# EasyEDA schematic DsKy with chained TM1638s.json
TITLE: DsKy w/Chained TM1636; REV: 1.0; Date: 2019-12-31; Sheet: 1/1; Drawn By: psnichols1; Company: Your Company
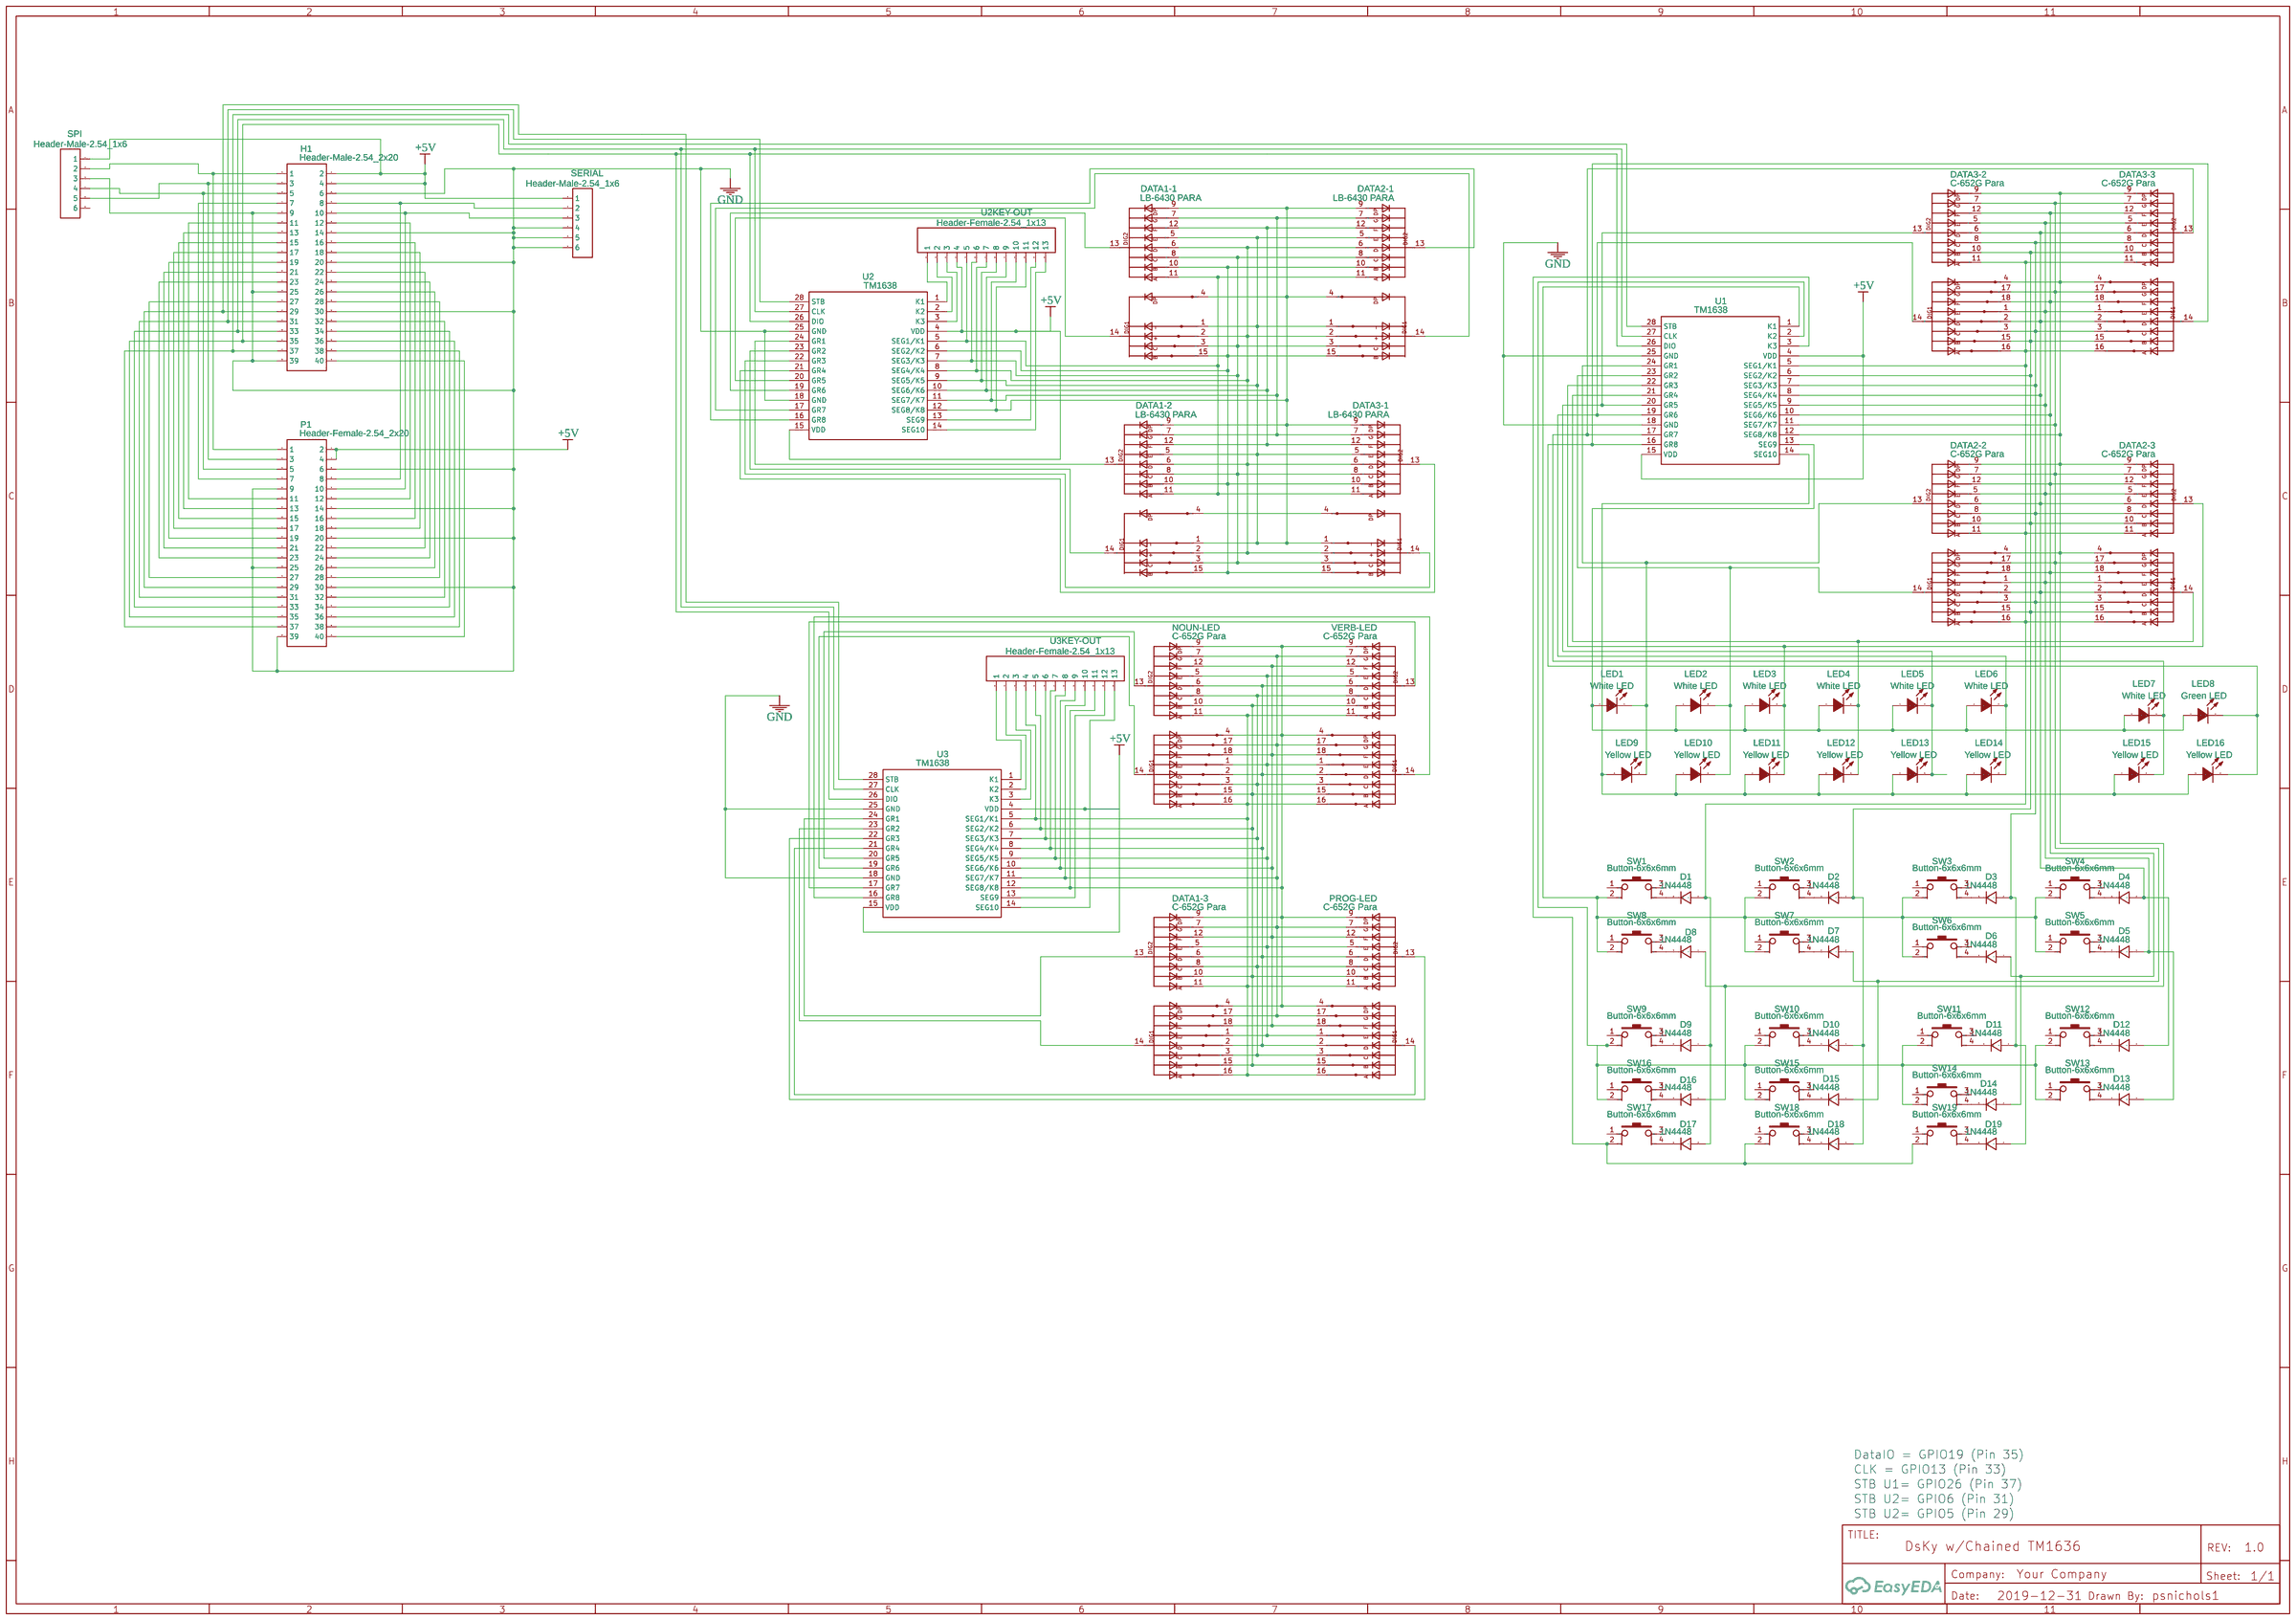
[diagram p0: schematic sheet]

## Parts
D1  1N4448  [DO-35]
D2  1N4448  [DO-35]
D3  1N4448  [DO-35]
D4  1N4448  [DO-35]
D5  1N4448  [DO-35]
D6  1N4448  [DO-35]
D7  1N4448  [DO-35]
D8  1N4448  [DO-35]
D9  1N4448  [DO-35]
D10  1N4448  [DO-35]
D11  1N4448  [DO-35]
D12  1N4448  [DO-35]
D13  1N4448  [DO-35]
D14  1N4448  [DO-35]
D15  1N4448  [DO-35]
D16  1N4448  [DO-35]
D17  1N4448  [DO-35]
D18  1N4448  [DO-35]
D19  1N4448  [DO-35]
DATA1-1  LB-6430 PARA  [LED-SEG-TH_TOD-3203FMR-1N]
DATA1-2  LB-6430 PARA  [LED-SEG-TH_TOD-3203FMR-1N]
DATA1-3  C-652G Para  [LED-SEG-TH_TOD-3203FMR-1N]
DATA2-1  LB-6430 PARA  [LED-SEG-TH_TOD-3203FMR-1N]
DATA2-2  C-652G Para  [LED-SEG-TH_TOD-3203FMR-1N]
DATA2-3  C-652G Para  [LED-SEG-TH_TOD-3203FMR-1N]
DATA3-1  LB-6430 PARA  [LED-SEG-TH_TOD-3203FMR-1N]
DATA3-2  C-652G Para  [LED-SEG-TH_TOD-3203FMR-1N]
DATA3-3  C-652G Para  [LED-SEG-TH_TOD-3203FMR-1N]
H1  Header-Male-2.54_2x20  [HDR-TH_40P-P2.54-V-R2-C20-S2.54]
LED1  White LED  [LED-3MM/2.54]
LED2  White LED  [LED-3MM/2.54]
LED3  White LED  [LED-3MM/2.54]
LED4  White LED  [LED-3MM/2.54]
LED5  White LED  [LED-3MM/2.54]
LED6  White LED  [LED-3MM/2.54]
LED7  White LED  [LED-3MM/2.54]
LED8  Green LED  [LED-3MM/2.54]
LED9  Yellow LED  [LED-3MM/2.54]
LED10  Yellow LED  [LED-3MM/2.54]
LED11  Yellow LED  [LED-3MM/2.54]
LED12  Yellow LED  [LED-3MM/2.54]
LED13  Yellow LED  [LED-3MM/2.54]
LED14  Yellow LED  [LED-3MM/2.54]
LED15  Yellow LED  [LED-3MM/2.54]
LED16  Yellow LED  [LED-3MM/2.54]
NOUN-LED  C-652G Para  [LED-SEG-TH_TOD-3203FMR-1N]
P1  Header-Female-2.54_2x20  [HDR-TH_40PIN-V-ROW2-COL20-FEMALE-PITCH2.54]
PROG-LED  C-652G Para  [LED-SEG-TH_TOD-3203FMR-1N]
SERIAL  Header-Male-2.54_1x6  [HDR-TH_6P-P2.54-V]
SPI  Header-Male-2.54_1x6  [HDR-TH_6P-P2.54-V]
SW1  Button-6x6x6mm  [SW-TH_4PIN-L6.00-W6.00]
SW2  Button-6x6x6mm  [SW-TH_4PIN-L6.00-W6.00]
SW3  Button-6x6x6mm  [SW-TH_4PIN-L6.00-W6.00]
SW4  Button-6x6x6mm  [SW-TH_4PIN-L6.00-W6.00]
SW5  Button-6x6x6mm  [SW-TH_4PIN-L6.00-W6.00]
SW6  Button-6x6x6mm  [SW-TH_4PIN-L6.00-W6.00]
SW7  Button-6x6x6mm  [SW-TH_4PIN-L6.00-W6.00]
SW8  Button-6x6x6mm  [SW-TH_4PIN-L6.00-W6.00]
SW9  Button-6x6x6mm  [SW-TH_4PIN-L6.00-W6.00]
SW10  Button-6x6x6mm  [SW-TH_4PIN-L6.00-W6.00]
SW11  Button-6x6x6mm  [SW-TH_4PIN-L6.00-W6.00]
SW12  Button-6x6x6mm  [SW-TH_4PIN-L6.00-W6.00]
SW13  Button-6x6x6mm  [SW-TH_4PIN-L6.00-W6.00]
SW14  Button-6x6x6mm  [SW-TH_4PIN-L6.00-W6.00]
SW15  Button-6x6x6mm  [SW-TH_4PIN-L6.00-W6.00]
SW16  Button-6x6x6mm  [SW-TH_4PIN-L6.00-W6.00]
SW17  Button-6x6x6mm  [SW-TH_4PIN-L6.00-W6.00]
SW18  Button-6x6x6mm  [SW-TH_4PIN-L6.00-W6.00]
SW19  Button-6x6x6mm  [SW-TH_4PIN-L6.00-W6.00]
U1  TM1638  [SOIC-28_300MIL]
U2  TM1638  [SOIC-28_300MIL]
U2KEY-OUT  Header-Female-2.54_1x13  [HDR-TH_13P-P2.54-V]
U3  TM1638  [SOIC-28_300MIL]
U3KEY-OUT  Header-Female-2.54_1x13  [HDR-TH_13P-P2.54-V]
VERB-LED  C-652G Para  [LED-SEG-TH_TOD-3203FMR-1N]

## Library data of the parts
D1-D19 = 1N4448: Supplier: LCSC; Manufacturer: SEMTECH; image: //image.lceda.cn/szlcsc/C54037.jpg; Supplier Part: C54037
DATA1-1 DATA1-2 DATA2-1 DATA3-1 = LB-6430 PARA: Supplier Part: Not Avail; Manufacturer: Para Light; Manufacturer Part: C-652G; Contributor: Peter Nichols
DATA1-3 DATA2-2 DATA2-3 DATA3-2 DATA3-3 NOUN-LED PROG-LED VERB-LED = C-652G Para: Supplier Part: Not Avail; Manufacturer: Para Light; Manufacturer Part: C-652G; Contributor: Peter Nichols
H1 = Header-Male-2.54_2x20: Supplier: LCSC; Manufacturer: ReliaPro; image: http://image.lceda.cn/szlcsc/C50980.jpg; Supplier Part: C50980
LED1-LED16 = 204-10SURD/S530-A3: Supplier: LCSC; Manufacturer: EVERLIGHT; Supplier Part: C99772
P1 = Header-Female-2.54_2x20: Supplier: LCSC; Manufacturer: BOOMELE; Manufacturer Part: 2.54mm 2*20PFemale header; image: //image.lceda.cn/szlcsc/C50982.jpg; Supplier Part: C50982
SERIAL SPI = Header-Male-2.54_1x6: Supplier: LCSC; Manufacturer: BOOMELE; Supplier Part: C37208
SW1-SW19 = Button-6x6x6mm: Supplier Part: C71836; Supplier: LCSC; Manufacturer: BBJ; Manufacturer Part: Switch,6*6*6Plastic head,260G, 0.25mm,Straight line
U1-U3 = TM1638: Supplier: LCSC; Manufacturer: TM; LCSC Assembly: Yes; image: //image.lceda.cn/szlcsc/C19187.jpg; Supplier Part: C19187; SMT Type: Basic
U2KEY-OUT U3KEY-OUT = Header-Female-2.54_1x13: Supplier: LCSC; Manufacturer: BOOMELE; Manufacturer Part: Female header 2.54-1*13P; Supplier Part: C52709

## Nets
+5V: H1.2 H1.4 P1.2 P1.4 SERIAL.1 SPI.1 U1.4(VDD) U1.15(VDD) U2.4(VDD) U2.15(VDD) U2KEY-OUT.4 U3.4(VDD) U3.15(VDD)
GND: H1.6 H1.9 H1.14 H1.20 H1.25 H1.30 H1.39 P1.6 P1.9 P1.14 P1.20 P1.25 P1.30 P1.39 SERIAL.4 SERIAL.5 SERIAL.6 SPI.3 U1.18(GND) U1.25(GND) U2.18(GND) U2.25(GND) U3.18(GND) U3.25(GND)
Net-(D1-1): D1.1(A) D9.1(A) D17.1(A) DATA2-2.11(3) DATA2-2.16(3) DATA2-3.11(3) DATA2-3.16(3) DATA3-2.11(3) DATA3-2.16(3) DATA3-3.11(3) DATA3-3.16(3) U1.5(SEG1/K1)
Net-(D1-2): D1.2(K) SW1.4
Net-(D2-1): D2.1(A) D10.1(A) D18.1(A) DATA2-2.10(3) DATA2-2.15(9) DATA2-3.10(3) DATA2-3.15(9) DATA3-2.10(3) DATA3-2.15(9) DATA3-3.10(3) DATA3-3.15(9) U1.6(SEG2/K2)
Net-(D2-2): D2.2(K) SW2.4
Net-(D3-1): D3.1(A) D11.1(A) D19.1(A) DATA2-2.3(8) DATA2-2.8(3) DATA2-3.3(8) DATA2-3.8(3) DATA3-2.3(8) DATA3-2.8(3) DATA3-3.3(8) DATA3-3.8(3) U1.7(SEG3/K3)
Net-(D3-2): D3.2(K) SW3.4
Net-(D4-1): D4.1(A) D12.1(A) DATA2-2.2(6) DATA2-2.6(3) DATA2-3.2(6) DATA2-3.6(3) DATA3-2.2(6) DATA3-2.6(3) DATA3-3.2(6) DATA3-3.6(3) U1.8(SEG4/K4)
Net-(D4-2): D4.2(K) SW4.4
Net-(D5-1): D5.1(A) D13.1(A) DATA2-2.1(7) DATA2-2.5(3) DATA2-3.1(7) DATA2-3.5(3) DATA3-2.1(7) DATA3-2.5(3) DATA3-3.1(7) DATA3-3.5(3) U1.9(SEG5/K5)
Net-(D5-2): D5.2(K) SW5.4
Net-(D6-1): D6.1(A) D14.1(A) DATA2-2.12(3) DATA2-2.18(4) DATA2-3.12(3) DATA2-3.18(4) DATA3-2.12(3) DATA3-2.18(4) DATA3-3.12(3) DATA3-3.18(4) U1.10(SEG6/K6)
Net-(D6-2): D6.2(K) SW6.4
Net-(D7-1): D7.1(A) D15.1(A) DATA2-2.7(3) DATA2-2.17(1) DATA2-3.7(3) DATA2-3.17(1) DATA3-2.7(3) DATA3-2.17(1) DATA3-3.7(3) DATA3-3.17(1) U1.11(SEG7/K7)
Net-(D7-2): D7.2(K) SW7.4
Net-(D8-1): D8.1(A) D16.1(A) DATA2-2.4(2) DATA2-2.9(3) DATA2-3.4(2) DATA2-3.9(3) DATA3-2.4(2) DATA3-2.9(3) DATA3-3.4(2) DATA3-3.9(3) U1.12(SEG8/K8)
Net-(D8-2): D8.2(K) SW8.4
Net-(D9-2): D9.2(K) SW9.4
Net-(D10-2): D10.2(K) SW10.4
Net-(D11-2): D11.2(K) SW11.4
Net-(D12-2): D12.2(K) SW12.4
Net-(D13-2): D13.2(K) SW13.4
Net-(D14-2): D14.2(K) SW14.4
Net-(D15-2): D15.2(K) SW15.4
Net-(D16-2): D16.2(K) SW16.4
Net-(D17-2): D17.2(K) SW17.4
Net-(D18-2): D18.2(K) SW18.4
Net-(D19-2): D19.2(K) SW19.4
Net-(DATA1-1-1): DATA1-1.1(7) DATA1-1.4(2) DATA1-1.5(3) DATA1-1.9(3) DATA1-2.1(7) DATA1-2.5(3) DATA1-2.9(3) DATA2-1.1(7) DATA2-1.4(2) DATA2-1.5(3) DATA2-1.9(3) DATA3-1.1(7) DATA3-1.5(3) DATA3-1.9(3) U2.9(SEG5/K5) U2.12(SEG8/K8) U2KEY-OUT.8 U2KEY-OUT.11
Net-(DATA1-1-2): DATA1-1.2(6) DATA1-1.6(3) DATA1-2.2(6) DATA1-2.6(3) DATA2-1.2(6) DATA2-1.6(3) DATA3-1.2(6) DATA3-1.6(3) U2.8(SEG4/K4) U2KEY-OUT.7
Net-(DATA1-1-3): DATA1-1.3(8) DATA1-1.8(3) DATA1-2.3(8) DATA1-2.8(3) DATA2-1.3(8) DATA2-1.8(3) DATA3-1.3(8) DATA3-1.8(3) U2.7(SEG3/K3) U2KEY-OUT.6
Net-(DATA1-1-7): DATA1-1.7(3) DATA1-2.7(3) DATA2-1.7(3) DATA3-1.7(3) U2.11(SEG7/K7) U2KEY-OUT.10
Net-(DATA1-1-10): DATA1-1.10(3) DATA1-1.15(9) DATA1-2.10(3) DATA1-2.15(9) DATA2-1.10(3) DATA2-1.15(9) DATA3-1.10(3) DATA3-1.15(9) U2.6(SEG2/K2)
Net-(DATA1-1-11): DATA1-1.11(3) DATA1-2.11(3) DATA2-1.11(3) DATA3-1.11(3) U2.5(SEG1/K1) U2KEY-OUT.5
Net-(DATA1-1-12): DATA1-1.12(3) DATA1-2.12(3) DATA2-1.12(3) DATA3-1.12(3) U2.10(SEG6/K6) U2KEY-OUT.9
Net-(DATA1-1-13): DATA1-1.13(5) U2.19(GR6)
Net-(DATA1-1-14): DATA1-1.14(10) U2.20(GR5)
Net-(DATA1-2-4): DATA1-2.4(2) DATA3-1.4(2)
Net-(DATA1-2-13): DATA1-2.13(5) U2.24(GR1)
Net-(DATA1-2-14): DATA1-2.14(10) U2.23(GR2)
Net-(DATA1-3-1): DATA1-3.1(7) DATA1-3.5(3) NOUN-LED.1(7) NOUN-LED.5(3) PROG-LED.1(7) PROG-LED.5(3) U3.9(SEG5/K5) U3KEY-OUT.8 VERB-LED.1(7) VERB-LED.5(3)
Net-(DATA1-3-2): DATA1-3.2(6) DATA1-3.6(3) NOUN-LED.2(6) NOUN-LED.6(3) PROG-LED.2(6) PROG-LED.6(3) U3.8(SEG4/K4) U3KEY-OUT.7 VERB-LED.2(6) VERB-LED.6(3)
Net-(DATA1-3-3): DATA1-3.3(8) DATA1-3.8(3) NOUN-LED.3(8) NOUN-LED.8(3) PROG-LED.3(8) PROG-LED.8(3) U3.7(SEG3/K3) U3KEY-OUT.6 VERB-LED.3(8) VERB-LED.8(3)
Net-(DATA1-3-4): DATA1-3.4(2) DATA1-3.9(3) NOUN-LED.4(2) NOUN-LED.9(3) PROG-LED.4(2) PROG-LED.9(3) U3.12(SEG8/K8) U3KEY-OUT.11 VERB-LED.4(2) VERB-LED.9(3)
Net-(DATA1-3-7): DATA1-3.7(3) DATA1-3.17(1) NOUN-LED.7(3) NOUN-LED.17(1) PROG-LED.7(3) PROG-LED.17(1) U3.11(SEG7/K7) U3KEY-OUT.10 VERB-LED.7(3) VERB-LED.17(1)
Net-(DATA1-3-10): DATA1-3.10(3) DATA1-3.15(9) NOUN-LED.10(3) NOUN-LED.15(9) PROG-LED.10(3) PROG-LED.15(9) U3.6(SEG2/K2) U3KEY-OUT.5 VERB-LED.10(3) VERB-LED.15(9)
Net-(DATA1-3-11): DATA1-3.11(3) DATA1-3.16(3) NOUN-LED.11(3) NOUN-LED.16(3) PROG-LED.11(3) PROG-LED.16(3) U3.5(SEG1/K1) U3KEY-OUT.4 VERB-LED.11(3) VERB-LED.16(3)
Net-(DATA1-3-12): DATA1-3.12(3) DATA1-3.18(4) NOUN-LED.12(3) NOUN-LED.18(4) PROG-LED.12(3) PROG-LED.18(4) U3.10(SEG6/K6) U3KEY-OUT.9 VERB-LED.12(3) VERB-LED.18(4)
Net-(DATA1-3-13): DATA1-3.13(5) U3.24(GR1)
Net-(DATA1-3-14): DATA1-3.14(10) U3.23(GR2)
Net-(DATA2-1-13): DATA2-1.13(5) U2.16(GR8)
Net-(DATA2-1-14): DATA2-1.14(10) U2.17(GR7)
Net-(DATA2-2-13): DATA2-2.13(5) LED1.2(K) LED9.2(K) U1.24(GR1)
Net-(DATA2-2-14): DATA2-2.14(10) LED2.2(K) LED10.2(K) U1.23(GR2)
Net-(DATA2-3-13): DATA2-3.13(5) LED3.2(K) LED11.2(K) U1.22(GR3)
Net-(DATA2-3-14): DATA2-3.14(10) LED4.2(K) LED12.2(K) U1.21(GR4)
Net-(DATA3-1-13): DATA3-1.13(5) U2.21(GR4)
Net-(DATA3-1-14): DATA3-1.14(10) U2.22(GR3)
Net-(DATA3-2-13): DATA3-2.13(5) LED5.2(K) LED13.2(K) U1.20(GR5)
Net-(DATA3-2-14): DATA3-2.14(10) LED6.2(K) LED14.2(K) U1.19(GR6)
Net-(DATA3-3-13): DATA3-3.13(5) LED7.2(K) LED15.2(K) U1.17(GR7)
Net-(DATA3-3-14): DATA3-3.14(10) LED8.2(K) LED16.2(K) U1.16(GR8)
Net-(H1-1): H1.1 P1.1 SPI.2
Net-(H1-3): H1.3 P1.3 SPI.5
Net-(H1-5): H1.5 P1.5 SPI.4
Net-(H1-7): H1.7 P1.7
Net-(H1-8): H1.8 P1.8 SERIAL.2
Net-(H1-10): H1.10 P1.10 SERIAL.3
Net-(H1-11): H1.11 P1.11
Net-(H1-12): H1.12 P1.12
Net-(H1-13): H1.13 P1.13
Net-(H1-15): H1.15 P1.15
Net-(H1-16): H1.16 P1.16
Net-(H1-17): H1.17 P1.17
Net-(H1-18): H1.18 P1.18
Net-(H1-19): H1.19 P1.19
Net-(H1-21): H1.21 P1.21
Net-(H1-22): H1.22 P1.22
Net-(H1-23): H1.23 P1.23
Net-(H1-24): H1.24 P1.24
Net-(H1-26): H1.26 P1.26
Net-(H1-27): H1.27 P1.27
Net-(H1-28): H1.28 P1.28
Net-(H1-29): H1.29 P1.29 U3.28(STB)
Net-(H1-31): H1.31 P1.31 U2.28(STB)
Net-(H1-32): H1.32 P1.32
Net-(H1-33): H1.33 P1.33 U1.27(CLK) U2.27(CLK) U3.27(CLK)
Net-(H1-34): H1.34 P1.34
Net-(H1-35): H1.35 P1.35 U1.26(DIO) U2.26(DIO) U3.26(DIO)
Net-(H1-36): H1.36 P1.36
Net-(H1-37): H1.37 P1.37 U1.28(STB)
Net-(H1-38): H1.38 P1.38
Net-(H1-40): H1.40 P1.40
Net-(LED1-1): LED1.1(A) LED2.1(A) LED3.1(A) LED4.1(A) LED5.1(A) LED6.1(A) LED7.1(A) LED8.1(A) U1.13(SEG9)
Net-(LED9-1): LED9.1(A) LED10.1(A) LED11.1(A) LED12.1(A) LED13.1(A) LED14.1(A) LED15.1(A) LED16.1(A) U1.14(SEG10)
Net-(NOUN-LED-13): NOUN-LED.13(5) U3.20(GR5)
Net-(NOUN-LED-14): NOUN-LED.14(10) U3.19(GR6)
Net-(PROG-LED-13): PROG-LED.13(5) U3.22(GR3)
Net-(PROG-LED-14): PROG-LED.14(10) U3.21(GR4)
Net-(SW1-2): SW1.2 SW2.2 SW3.2 SW4.2 SW5.2 SW6.2 SW7.2 SW8.2 U1.1(K1)
Net-(SW9-2): SW9.2 SW10.2 SW11.2 SW12.2 SW13.2 SW14.2 SW15.2 SW16.2 U1.2(K2)
Net-(SW17-2): SW17.2 SW18.2 SW19.2 U1.3(K3)
Net-(U2-1): U2.1(K1) U2KEY-OUT.1
Net-(U2-2): U2.2(K2) U2KEY-OUT.2
Net-(U2-3): U2.3(K3) U2KEY-OUT.3
Net-(U2-13): U2.13(SEG9) U2KEY-OUT.12
Net-(U2-14): U2.14(SEG10) U2KEY-OUT.13
Net-(U3-1): U3.1(K1) U3KEY-OUT.1
Net-(U3-2): U3.2(K2) U3KEY-OUT.2
Net-(U3-3): U3.3(K3) U3KEY-OUT.3
Net-(U3-13): U3.13(SEG9) U3KEY-OUT.12
Net-(U3-14): U3.14(SEG10) U3KEY-OUT.13
Net-(U3-16): U3.16(GR8) VERB-LED.14(10)
Net-(U3-17): U3.17(GR7) VERB-LED.13(5)

Not connected (* = marked no-connect by the designer): SPI 6; SW1 1 3; SW2 1 3; SW3 1 3; SW4 1 3; SW5 1 3; SW6 1 3; SW7 1 3; SW8 1 3; SW9 1 3; SW10 1 3; SW11 1 3; SW12 1 3; SW13 1 3; SW14 1 3; SW15 1 3; SW16 1 3; SW17 1 3; SW18 1 3; SW19 1 3

## Notes on the sheet
- DataIO = GPIO19 (Pin 35)
- CLK = GPIO13 (Pin 33)
- STB U1= GPIO26 (Pin 37)
- STB U2= GPIO6 (Pin 31)
- STB U2= GPIO5 (Pin 29)
